# EAGLE design ADG719-Breakout (EAGLE 7.7.0)
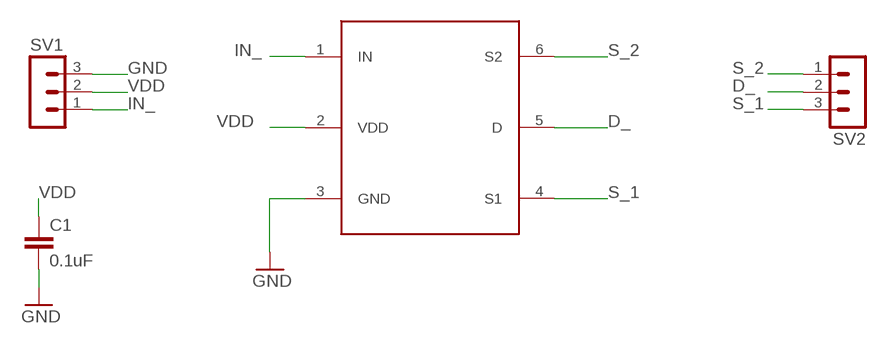
[diagram p0: schematic, sheet 1]

## Parts
C1  0.1uF  C-EUC0805  [C0805]
SV1  MA03-1  [MA03-1]
SV2  MA03-1  [MA03-1]
U$1  ADG719  [ADG719]

## Nets
D_: SV2.2 U$1.5(D)
GND: C1.2 SV1.3 U$1.3(GND)
IN_: SV1.1 U$1.1(IN)
S_1: SV2.3 U$1.4(S1)
S_2: SV2.1 U$1.6(S2)
VDD: C1.1 SV1.2 U$1.2(VDD)

## Library data of the parts
C1 = rcl:C-EU: CAPACITOR, European symbol
SV1 SV2 = con-lstb:MA03-1: PIN HEADER; OC_FARNELL: unknown; OC_NEWARK: unknown
U$1 = ADG719:ADG719: The ADG719 is a monolithic CMOS SPDT switch. This switch is designed on a submicron process that provides low power dissipation yet gives high switching speed, low on resistance, and low leakage currents.

## Board
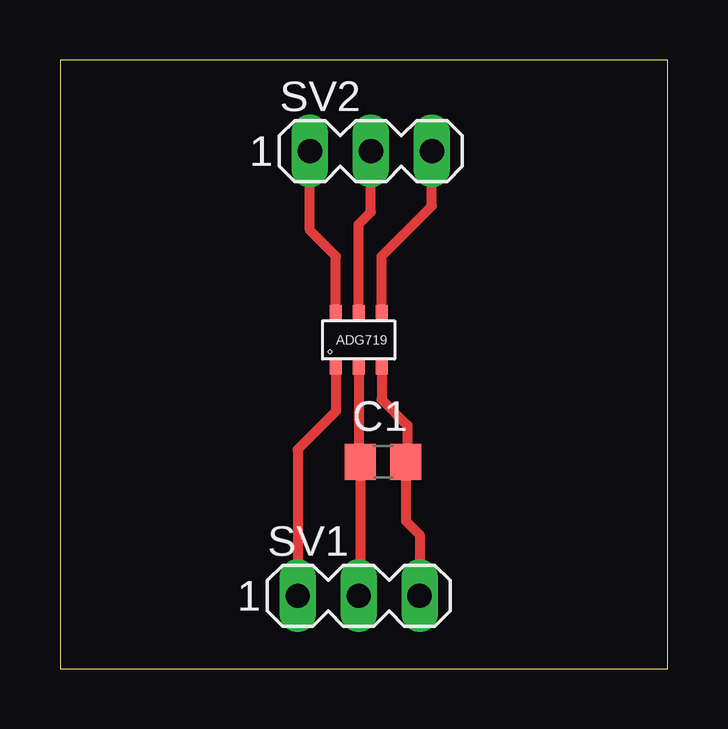
[diagram p1: board, top side]

Size 25.32 x 25.39 mm. Coordinates in mm from the lower left corner, seen from the top.
Outline: 0,0 25.32,0 25.32,25.39 0,25.39 0,0
Copper layers (1*16): Top 0.035mm / dielectric 1.5mm / Bottom 0.035mm
Design rules "default": minimum track width 10mil, minimum drill 24mil, track to track 8mil, track to pad 8mil, pad to pad 8mil, via to via 8mil, smd to smd 8mil, copper to edge 40mil, drill to drill 8mil, minimum pad ring 10mil, minimum via ring 8mil, stop-mask expansion 4mil, vias tented up to drill 0mil, thermal gap 10mil

### Footprints (pad centres in the part's own frame; a part is rotated, then mirrored left to right if it is on the bottom)
C0805 = smd 1.3 x 1.5: 1 -0.95,0; 2 0.95,0
MA03-1 = drill 1.016 long: 1 -2.54,0; 2 0,0; 3 2.54,0
ADG719 = smd 0.5 x 0.6: 1 -0.95,-1.15; 2 0,-1.15; 3 0.95,-1.15; 4 0.95,1.15; 5 0,1.15; 6 -0.95,1.15

### Placement (x,y rotation side)
C1  13.46,8.64 0 top
SV1  12.45,3.05 0 top
SV2  12.95,21.59 0 top
U$1  12.45,13.72 0 top

### Tracks (layer width: path | path; a pad name or v marks a point on that pad's centre or on a via)
D_
  Top 0.406: U$1.5 12.45,18.54 12.95,19.05 SV2.2
GND
  Top 0.406: U$1.3 13.4,11.24 14.48,10.16 14.48,8.7 C1.2 14.41,6.16 14.99,5.59 SV1.3
IN_
  Top 0.406: U$1.1 11.5,10.73 9.91,9.14 SV1.1
S_1
  Top 0.406: U$1.4 13.4,17.21 15.49,19.3 SV2.3
S_2
  Top 0.406: U$1.6 11.5,17.21 10.41,18.29 SV2.1
VDD
  Top 0.406: U$1.2 12.45,8.7 C1.1 12.51,3.11 SV1.2